# EasyEDA schematic cc2_schematic.json
TITLE: Foxie CardClock 2.0; REV: 1.1; Date: Oct 27, 2023; Sheet: 1/1; Drawn By: Will Fox; Company: Foxie Products
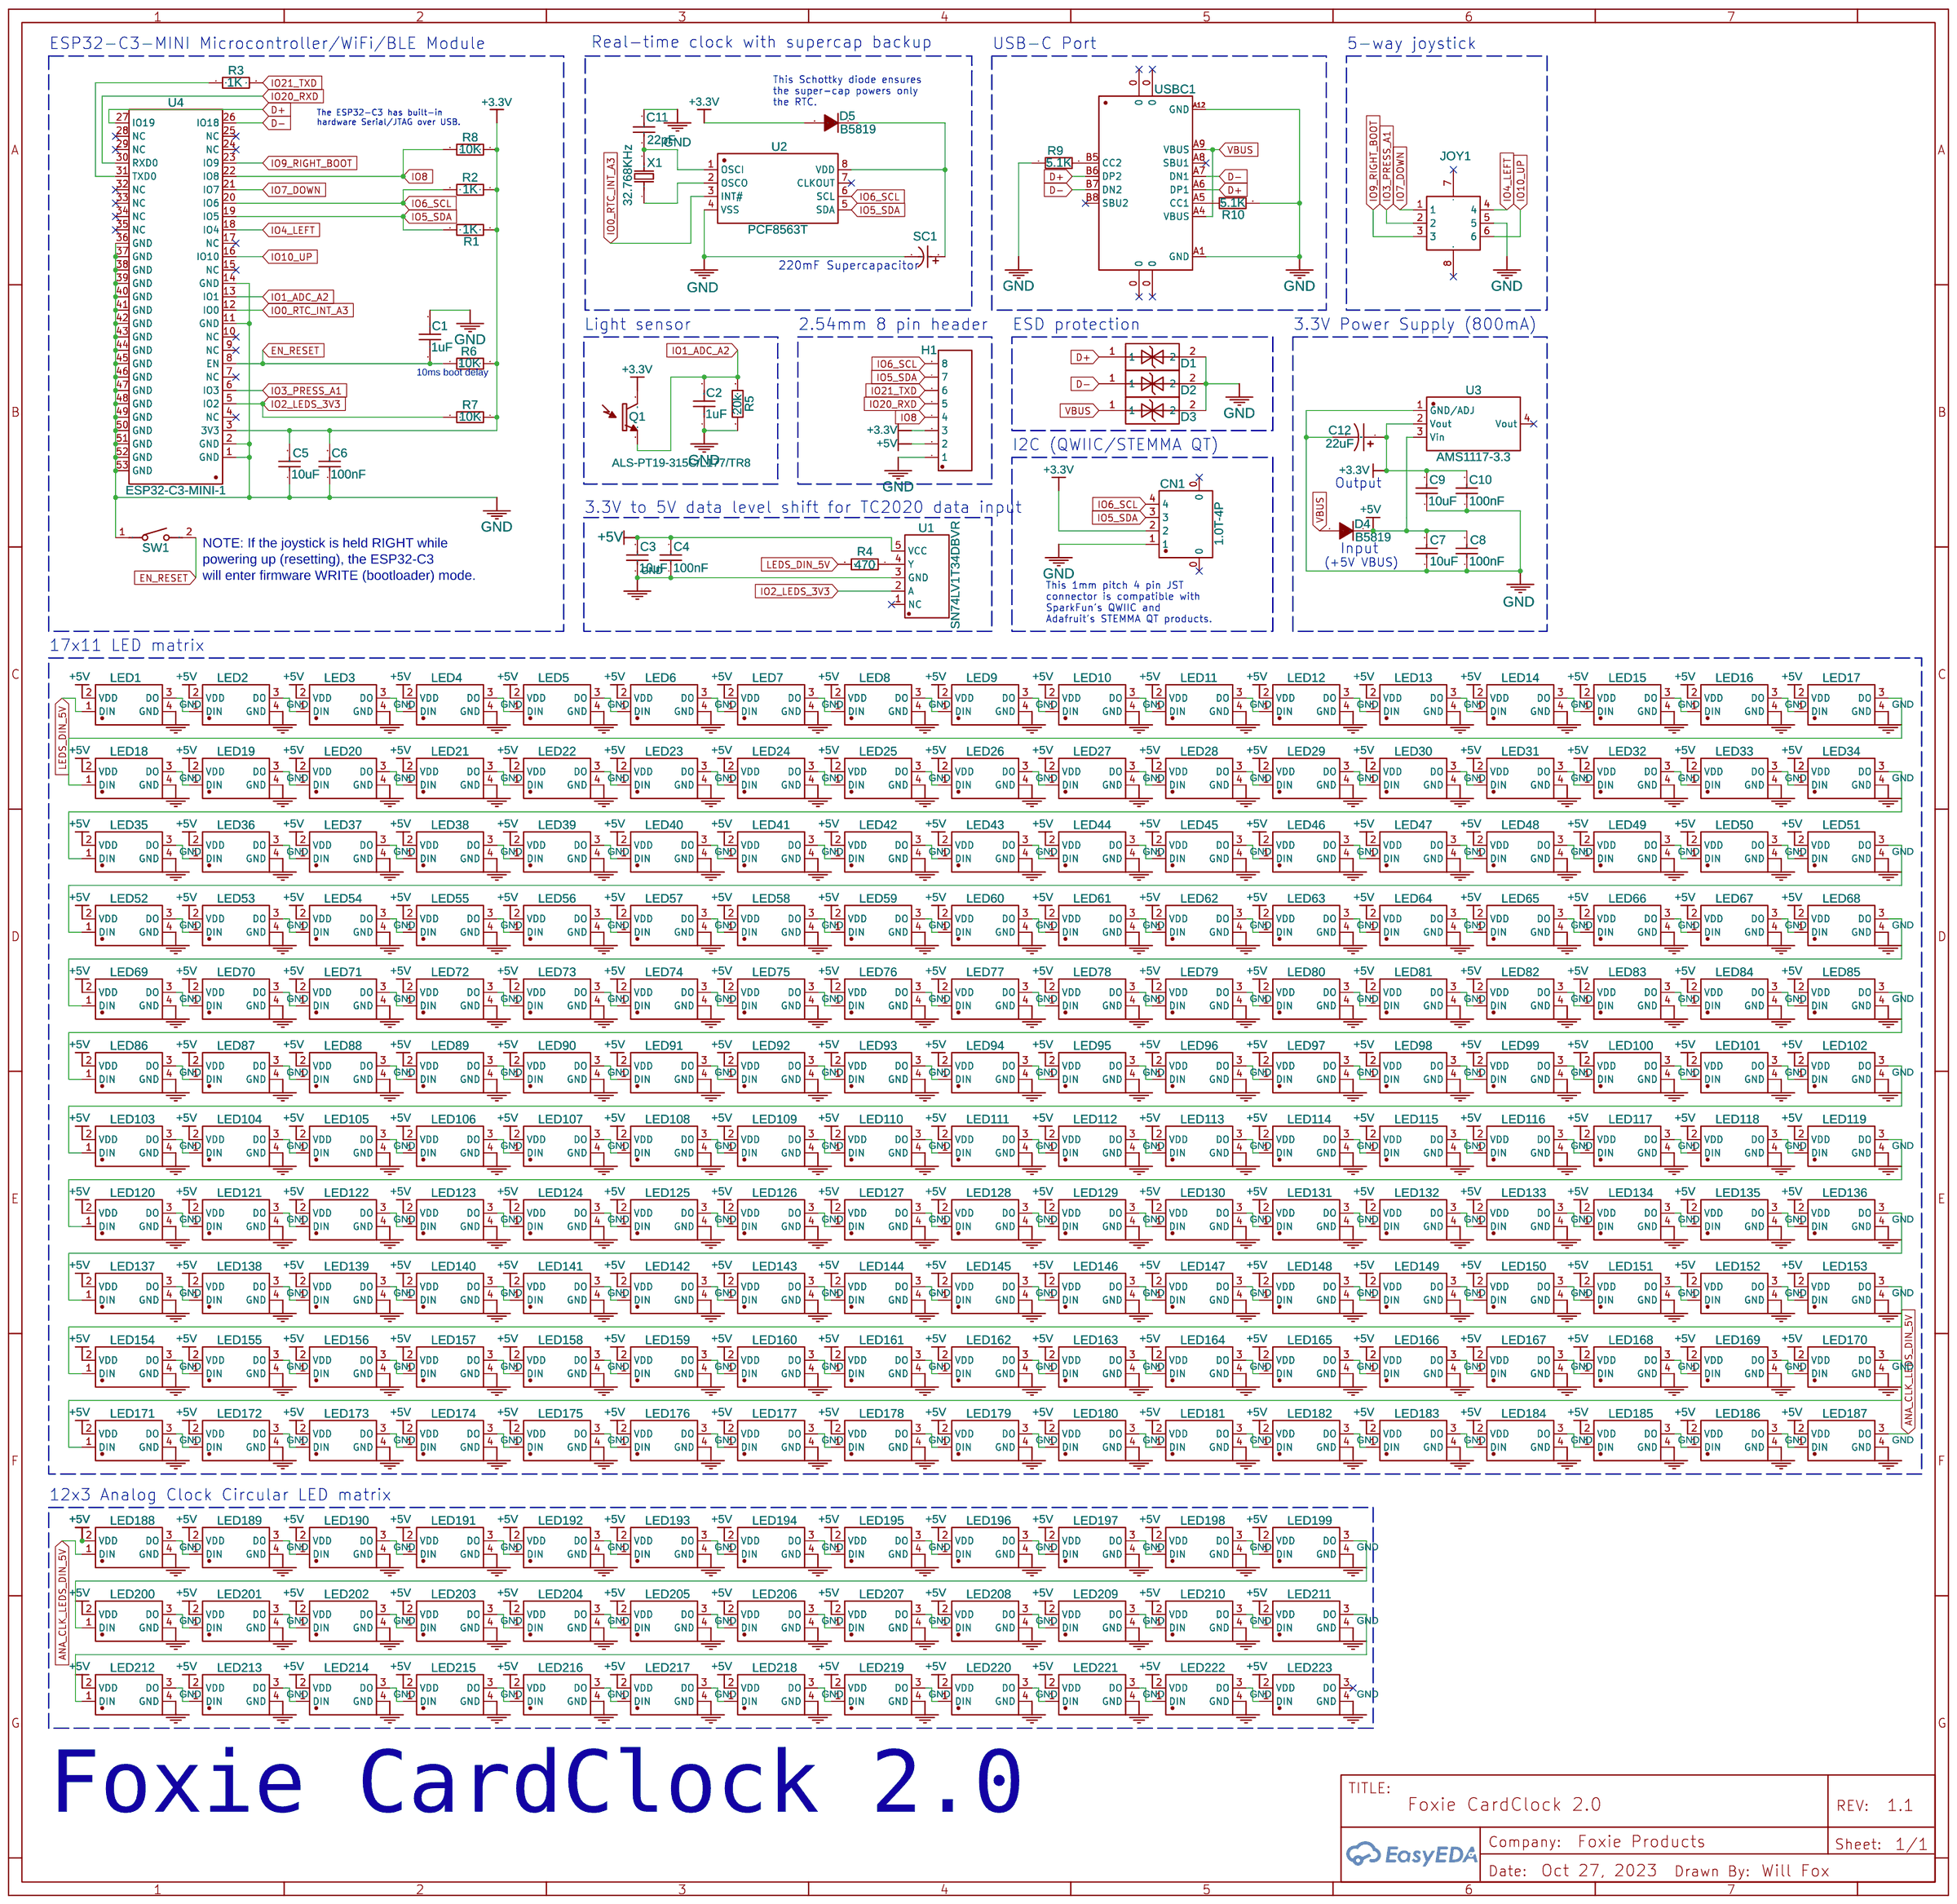
[diagram p0: schematic sheet]

## Parts
C1  1uF  [C0402]
C2  1uF  [C0402]
C3  10uF  [C0402]
C4  100nF  [C0402]
C5  10uF  [C0402]
C6  100nF  [C0402]
C7  10uF  [C0402]
C8  100nF  [C0402]
C9  10uF  [C0402]
C10  100nF  [C0402]
C11  22pF  [C0402]
C12  22uF  [CAP-SMD_L3.2-W1.6-RD]
CN1  1.0T-4P  [CONN-SMD_1.0T-4P]
D1  ULCE1005A015FR  [D0603-BI]
D2  ULCE1005A015FR  [D0603-BI]
D3  ULCE1005A015FR  [D0603-BI]
D4  B5819  [SOD-123_L2.8-W1.8-LS3.7-RD]
D5  B5819  [SOD-123_L2.8-W1.8-LS3.7-RD]
H1  Header-Male-2.54_1x8  [HDR-TH_8P-P2.54-V-M_OFFSET_PINS]
JOY1  K1-5202UA-02  [SW-SMD_K1-5202UA-02]
LED1  TC2020RGB-3CJH-TX1812Z5  [LED-SMD_4P-L2.1-W2.1-TL_TC2020RGB]
LED2  TC2020RGB-3CJH-TX1812Z5  [LED-SMD_4P-L2.1-W2.1-TL_TC2020RGB]
LED3  TC2020RGB-3CJH-TX1812Z5  [LED-SMD_4P-L2.1-W2.1-TL_TC2020RGB]
LED4  TC2020RGB-3CJH-TX1812Z5  [LED-SMD_4P-L2.1-W2.1-TL_TC2020RGB]
LED5  TC2020RGB-3CJH-TX1812Z5  [LED-SMD_4P-L2.1-W2.1-TL_TC2020RGB]
LED6  TC2020RGB-3CJH-TX1812Z5  [LED-SMD_4P-L2.1-W2.1-TL_TC2020RGB]
LED7  TC2020RGB-3CJH-TX1812Z5  [LED-SMD_4P-L2.1-W2.1-TL_TC2020RGB]
LED8  TC2020RGB-3CJH-TX1812Z5  [LED-SMD_4P-L2.1-W2.1-TL_TC2020RGB]
LED9  TC2020RGB-3CJH-TX1812Z5  [LED-SMD_4P-L2.1-W2.1-TL_TC2020RGB]
LED10  TC2020RGB-3CJH-TX1812Z5  [LED-SMD_4P-L2.1-W2.1-TL_TC2020RGB]
LED11  TC2020RGB-3CJH-TX1812Z5  [LED-SMD_4P-L2.1-W2.1-TL_TC2020RGB]
LED12  TC2020RGB-3CJH-TX1812Z5  [LED-SMD_4P-L2.1-W2.1-TL_TC2020RGB]
LED13  TC2020RGB-3CJH-TX1812Z5  [LED-SMD_4P-L2.1-W2.1-TL_TC2020RGB]
LED14  TC2020RGB-3CJH-TX1812Z5  [LED-SMD_4P-L2.1-W2.1-TL_TC2020RGB]
LED15  TC2020RGB-3CJH-TX1812Z5  [LED-SMD_4P-L2.1-W2.1-TL_TC2020RGB]
LED16  TC2020RGB-3CJH-TX1812Z5  [LED-SMD_4P-L2.1-W2.1-TL_TC2020RGB]
LED17  TC2020RGB-3CJH-TX1812Z5  [LED-SMD_4P-L2.1-W2.1-TL_TC2020RGB]
LED18  TC2020RGB-3CJH-TX1812Z5  [LED-SMD_4P-L2.1-W2.1-TL_TC2020RGB]
LED19  TC2020RGB-3CJH-TX1812Z5  [LED-SMD_4P-L2.1-W2.1-TL_TC2020RGB]
LED20  TC2020RGB-3CJH-TX1812Z5  [LED-SMD_4P-L2.1-W2.1-TL_TC2020RGB]
LED21  TC2020RGB-3CJH-TX1812Z5  [LED-SMD_4P-L2.1-W2.1-TL_TC2020RGB]
LED22  TC2020RGB-3CJH-TX1812Z5  [LED-SMD_4P-L2.1-W2.1-TL_TC2020RGB]
LED23  TC2020RGB-3CJH-TX1812Z5  [LED-SMD_4P-L2.1-W2.1-TL_TC2020RGB]
LED24  TC2020RGB-3CJH-TX1812Z5  [LED-SMD_4P-L2.1-W2.1-TL_TC2020RGB]
LED25  TC2020RGB-3CJH-TX1812Z5  [LED-SMD_4P-L2.1-W2.1-TL_TC2020RGB]
LED26  TC2020RGB-3CJH-TX1812Z5  [LED-SMD_4P-L2.1-W2.1-TL_TC2020RGB]
LED27  TC2020RGB-3CJH-TX1812Z5  [LED-SMD_4P-L2.1-W2.1-TL_TC2020RGB]
LED28  TC2020RGB-3CJH-TX1812Z5  [LED-SMD_4P-L2.1-W2.1-TL_TC2020RGB]
LED29  TC2020RGB-3CJH-TX1812Z5  [LED-SMD_4P-L2.1-W2.1-TL_TC2020RGB]
LED30  TC2020RGB-3CJH-TX1812Z5  [LED-SMD_4P-L2.1-W2.1-TL_TC2020RGB]
LED31  TC2020RGB-3CJH-TX1812Z5  [LED-SMD_4P-L2.1-W2.1-TL_TC2020RGB]
LED32  TC2020RGB-3CJH-TX1812Z5  [LED-SMD_4P-L2.1-W2.1-TL_TC2020RGB]
LED33  TC2020RGB-3CJH-TX1812Z5  [LED-SMD_4P-L2.1-W2.1-TL_TC2020RGB]
LED34  TC2020RGB-3CJH-TX1812Z5  [LED-SMD_4P-L2.1-W2.1-TL_TC2020RGB]
LED35  TC2020RGB-3CJH-TX1812Z5  [LED-SMD_4P-L2.1-W2.1-TL_TC2020RGB]
LED36  TC2020RGB-3CJH-TX1812Z5  [LED-SMD_4P-L2.1-W2.1-TL_TC2020RGB]
LED37  TC2020RGB-3CJH-TX1812Z5  [LED-SMD_4P-L2.1-W2.1-TL_TC2020RGB]
LED38  TC2020RGB-3CJH-TX1812Z5  [LED-SMD_4P-L2.1-W2.1-TL_TC2020RGB]
LED39  TC2020RGB-3CJH-TX1812Z5  [LED-SMD_4P-L2.1-W2.1-TL_TC2020RGB]
LED40  TC2020RGB-3CJH-TX1812Z5  [LED-SMD_4P-L2.1-W2.1-TL_TC2020RGB]
LED41  TC2020RGB-3CJH-TX1812Z5  [LED-SMD_4P-L2.1-W2.1-TL_TC2020RGB]
LED42  TC2020RGB-3CJH-TX1812Z5  [LED-SMD_4P-L2.1-W2.1-TL_TC2020RGB]
LED43  TC2020RGB-3CJH-TX1812Z5  [LED-SMD_4P-L2.1-W2.1-TL_TC2020RGB]
LED44  TC2020RGB-3CJH-TX1812Z5  [LED-SMD_4P-L2.1-W2.1-TL_TC2020RGB]
LED45  TC2020RGB-3CJH-TX1812Z5  [LED-SMD_4P-L2.1-W2.1-TL_TC2020RGB]
LED46  TC2020RGB-3CJH-TX1812Z5  [LED-SMD_4P-L2.1-W2.1-TL_TC2020RGB]
LED47  TC2020RGB-3CJH-TX1812Z5  [LED-SMD_4P-L2.1-W2.1-TL_TC2020RGB]
LED48  TC2020RGB-3CJH-TX1812Z5  [LED-SMD_4P-L2.1-W2.1-TL_TC2020RGB]
LED49  TC2020RGB-3CJH-TX1812Z5  [LED-SMD_4P-L2.1-W2.1-TL_TC2020RGB]
LED50  TC2020RGB-3CJH-TX1812Z5  [LED-SMD_4P-L2.1-W2.1-TL_TC2020RGB]
LED51  TC2020RGB-3CJH-TX1812Z5  [LED-SMD_4P-L2.1-W2.1-TL_TC2020RGB]
LED52  TC2020RGB-3CJH-TX1812Z5  [LED-SMD_4P-L2.1-W2.1-TL_TC2020RGB]
LED53  TC2020RGB-3CJH-TX1812Z5  [LED-SMD_4P-L2.1-W2.1-TL_TC2020RGB]
LED54  TC2020RGB-3CJH-TX1812Z5  [LED-SMD_4P-L2.1-W2.1-TL_TC2020RGB]
LED55  TC2020RGB-3CJH-TX1812Z5  [LED-SMD_4P-L2.1-W2.1-TL_TC2020RGB]
LED56  TC2020RGB-3CJH-TX1812Z5  [LED-SMD_4P-L2.1-W2.1-TL_TC2020RGB]
LED57  TC2020RGB-3CJH-TX1812Z5  [LED-SMD_4P-L2.1-W2.1-TL_TC2020RGB]
LED58  TC2020RGB-3CJH-TX1812Z5  [LED-SMD_4P-L2.1-W2.1-TL_TC2020RGB]
LED59  TC2020RGB-3CJH-TX1812Z5  [LED-SMD_4P-L2.1-W2.1-TL_TC2020RGB]
LED60  TC2020RGB-3CJH-TX1812Z5  [LED-SMD_4P-L2.1-W2.1-TL_TC2020RGB]
LED61  TC2020RGB-3CJH-TX1812Z5  [LED-SMD_4P-L2.1-W2.1-TL_TC2020RGB]
LED62  TC2020RGB-3CJH-TX1812Z5  [LED-SMD_4P-L2.1-W2.1-TL_TC2020RGB]
LED63  TC2020RGB-3CJH-TX1812Z5  [LED-SMD_4P-L2.1-W2.1-TL_TC2020RGB]
LED64  TC2020RGB-3CJH-TX1812Z5  [LED-SMD_4P-L2.1-W2.1-TL_TC2020RGB]
LED65  TC2020RGB-3CJH-TX1812Z5  [LED-SMD_4P-L2.1-W2.1-TL_TC2020RGB]
LED66  TC2020RGB-3CJH-TX1812Z5  [LED-SMD_4P-L2.1-W2.1-TL_TC2020RGB]
LED67  TC2020RGB-3CJH-TX1812Z5  [LED-SMD_4P-L2.1-W2.1-TL_TC2020RGB]
LED68  TC2020RGB-3CJH-TX1812Z5  [LED-SMD_4P-L2.1-W2.1-TL_TC2020RGB]
LED69  TC2020RGB-3CJH-TX1812Z5  [LED-SMD_4P-L2.1-W2.1-TL_TC2020RGB]
LED70  TC2020RGB-3CJH-TX1812Z5  [LED-SMD_4P-L2.1-W2.1-TL_TC2020RGB]
LED71  TC2020RGB-3CJH-TX1812Z5  [LED-SMD_4P-L2.1-W2.1-TL_TC2020RGB]
LED72  TC2020RGB-3CJH-TX1812Z5  [LED-SMD_4P-L2.1-W2.1-TL_TC2020RGB]
LED73  TC2020RGB-3CJH-TX1812Z5  [LED-SMD_4P-L2.1-W2.1-TL_TC2020RGB]
LED74  TC2020RGB-3CJH-TX1812Z5  [LED-SMD_4P-L2.1-W2.1-TL_TC2020RGB]
LED75  TC2020RGB-3CJH-TX1812Z5  [LED-SMD_4P-L2.1-W2.1-TL_TC2020RGB]
LED76  TC2020RGB-3CJH-TX1812Z5  [LED-SMD_4P-L2.1-W2.1-TL_TC2020RGB]
LED77  TC2020RGB-3CJH-TX1812Z5  [LED-SMD_4P-L2.1-W2.1-TL_TC2020RGB]
LED78  TC2020RGB-3CJH-TX1812Z5  [LED-SMD_4P-L2.1-W2.1-TL_TC2020RGB]
LED79  TC2020RGB-3CJH-TX1812Z5  [LED-SMD_4P-L2.1-W2.1-TL_TC2020RGB]
LED80  TC2020RGB-3CJH-TX1812Z5  [LED-SMD_4P-L2.1-W2.1-TL_TC2020RGB]
LED81  TC2020RGB-3CJH-TX1812Z5  [LED-SMD_4P-L2.1-W2.1-TL_TC2020RGB]
LED82  TC2020RGB-3CJH-TX1812Z5  [LED-SMD_4P-L2.1-W2.1-TL_TC2020RGB]
LED83  TC2020RGB-3CJH-TX1812Z5  [LED-SMD_4P-L2.1-W2.1-TL_TC2020RGB]
LED84  TC2020RGB-3CJH-TX1812Z5  [LED-SMD_4P-L2.1-W2.1-TL_TC2020RGB]
LED85  TC2020RGB-3CJH-TX1812Z5  [LED-SMD_4P-L2.1-W2.1-TL_TC2020RGB]
LED86  TC2020RGB-3CJH-TX1812Z5  [LED-SMD_4P-L2.1-W2.1-TL_TC2020RGB]
LED87  TC2020RGB-3CJH-TX1812Z5  [LED-SMD_4P-L2.1-W2.1-TL_TC2020RGB]
LED88  TC2020RGB-3CJH-TX1812Z5  [LED-SMD_4P-L2.1-W2.1-TL_TC2020RGB]
LED89  TC2020RGB-3CJH-TX1812Z5  [LED-SMD_4P-L2.1-W2.1-TL_TC2020RGB]
LED90  TC2020RGB-3CJH-TX1812Z5  [LED-SMD_4P-L2.1-W2.1-TL_TC2020RGB]
LED91  TC2020RGB-3CJH-TX1812Z5  [LED-SMD_4P-L2.1-W2.1-TL_TC2020RGB]
LED92  TC2020RGB-3CJH-TX1812Z5  [LED-SMD_4P-L2.1-W2.1-TL_TC2020RGB]
LED93  TC2020RGB-3CJH-TX1812Z5  [LED-SMD_4P-L2.1-W2.1-TL_TC2020RGB]
LED94  TC2020RGB-3CJH-TX1812Z5  [LED-SMD_4P-L2.1-W2.1-TL_TC2020RGB]
LED95  TC2020RGB-3CJH-TX1812Z5  [LED-SMD_4P-L2.1-W2.1-TL_TC2020RGB]
LED96  TC2020RGB-3CJH-TX1812Z5  [LED-SMD_4P-L2.1-W2.1-TL_TC2020RGB]
LED97  TC2020RGB-3CJH-TX1812Z5  [LED-SMD_4P-L2.1-W2.1-TL_TC2020RGB]
LED98  TC2020RGB-3CJH-TX1812Z5  [LED-SMD_4P-L2.1-W2.1-TL_TC2020RGB]
LED99  TC2020RGB-3CJH-TX1812Z5  [LED-SMD_4P-L2.1-W2.1-TL_TC2020RGB]
LED100  TC2020RGB-3CJH-TX1812Z5  [LED-SMD_4P-L2.1-W2.1-TL_TC2020RGB]
LED101  TC2020RGB-3CJH-TX1812Z5  [LED-SMD_4P-L2.1-W2.1-TL_TC2020RGB]
LED102  TC2020RGB-3CJH-TX1812Z5  [LED-SMD_4P-L2.1-W2.1-TL_TC2020RGB]
LED103  TC2020RGB-3CJH-TX1812Z5  [LED-SMD_4P-L2.1-W2.1-TL_TC2020RGB]
LED104  TC2020RGB-3CJH-TX1812Z5  [LED-SMD_4P-L2.1-W2.1-TL_TC2020RGB]
LED105  TC2020RGB-3CJH-TX1812Z5  [LED-SMD_4P-L2.1-W2.1-TL_TC2020RGB]
LED106  TC2020RGB-3CJH-TX1812Z5  [LED-SMD_4P-L2.1-W2.1-TL_TC2020RGB]
LED107  TC2020RGB-3CJH-TX1812Z5  [LED-SMD_4P-L2.1-W2.1-TL_TC2020RGB]
LED108  TC2020RGB-3CJH-TX1812Z5  [LED-SMD_4P-L2.1-W2.1-TL_TC2020RGB]
LED109  TC2020RGB-3CJH-TX1812Z5  [LED-SMD_4P-L2.1-W2.1-TL_TC2020RGB]
LED110  TC2020RGB-3CJH-TX1812Z5  [LED-SMD_4P-L2.1-W2.1-TL_TC2020RGB]
LED111  TC2020RGB-3CJH-TX1812Z5  [LED-SMD_4P-L2.1-W2.1-TL_TC2020RGB]
LED112  TC2020RGB-3CJH-TX1812Z5  [LED-SMD_4P-L2.1-W2.1-TL_TC2020RGB]
LED113  TC2020RGB-3CJH-TX1812Z5  [LED-SMD_4P-L2.1-W2.1-TL_TC2020RGB]
LED114  TC2020RGB-3CJH-TX1812Z5  [LED-SMD_4P-L2.1-W2.1-TL_TC2020RGB]
LED115  TC2020RGB-3CJH-TX1812Z5  [LED-SMD_4P-L2.1-W2.1-TL_TC2020RGB]
LED116  TC2020RGB-3CJH-TX1812Z5  [LED-SMD_4P-L2.1-W2.1-TL_TC2020RGB]
LED117  TC2020RGB-3CJH-TX1812Z5  [LED-SMD_4P-L2.1-W2.1-TL_TC2020RGB]
LED118  TC2020RGB-3CJH-TX1812Z5  [LED-SMD_4P-L2.1-W2.1-TL_TC2020RGB]
LED119  TC2020RGB-3CJH-TX1812Z5  [LED-SMD_4P-L2.1-W2.1-TL_TC2020RGB]
LED120  TC2020RGB-3CJH-TX1812Z5  [LED-SMD_4P-L2.1-W2.1-TL_TC2020RGB]
LED121  TC2020RGB-3CJH-TX1812Z5  [LED-SMD_4P-L2.1-W2.1-TL_TC2020RGB]
LED122  TC2020RGB-3CJH-TX1812Z5  [LED-SMD_4P-L2.1-W2.1-TL_TC2020RGB]
LED123  TC2020RGB-3CJH-TX1812Z5  [LED-SMD_4P-L2.1-W2.1-TL_TC2020RGB]
LED124  TC2020RGB-3CJH-TX1812Z5  [LED-SMD_4P-L2.1-W2.1-TL_TC2020RGB]
LED125  TC2020RGB-3CJH-TX1812Z5  [LED-SMD_4P-L2.1-W2.1-TL_TC2020RGB]
LED126  TC2020RGB-3CJH-TX1812Z5  [LED-SMD_4P-L2.1-W2.1-TL_TC2020RGB]
LED127  TC2020RGB-3CJH-TX1812Z5  [LED-SMD_4P-L2.1-W2.1-TL_TC2020RGB]
LED128  TC2020RGB-3CJH-TX1812Z5  [LED-SMD_4P-L2.1-W2.1-TL_TC2020RGB]
LED129  TC2020RGB-3CJH-TX1812Z5  [LED-SMD_4P-L2.1-W2.1-TL_TC2020RGB]
LED130  TC2020RGB-3CJH-TX1812Z5  [LED-SMD_4P-L2.1-W2.1-TL_TC2020RGB]
LED131  TC2020RGB-3CJH-TX1812Z5  [LED-SMD_4P-L2.1-W2.1-TL_TC2020RGB]
LED132  TC2020RGB-3CJH-TX1812Z5  [LED-SMD_4P-L2.1-W2.1-TL_TC2020RGB]
LED133  TC2020RGB-3CJH-TX1812Z5  [LED-SMD_4P-L2.1-W2.1-TL_TC2020RGB]
LED134  TC2020RGB-3CJH-TX1812Z5  [LED-SMD_4P-L2.1-W2.1-TL_TC2020RGB]
LED135  TC2020RGB-3CJH-TX1812Z5  [LED-SMD_4P-L2.1-W2.1-TL_TC2020RGB]
LED136  TC2020RGB-3CJH-TX1812Z5  [LED-SMD_4P-L2.1-W2.1-TL_TC2020RGB]
LED137  TC2020RGB-3CJH-TX1812Z5  [LED-SMD_4P-L2.1-W2.1-TL_TC2020RGB]
LED138  TC2020RGB-3CJH-TX1812Z5  [LED-SMD_4P-L2.1-W2.1-TL_TC2020RGB]
LED139  TC2020RGB-3CJH-TX1812Z5  [LED-SMD_4P-L2.1-W2.1-TL_TC2020RGB]
LED140  TC2020RGB-3CJH-TX1812Z5  [LED-SMD_4P-L2.1-W2.1-TL_TC2020RGB]
LED141  TC2020RGB-3CJH-TX1812Z5  [LED-SMD_4P-L2.1-W2.1-TL_TC2020RGB]
LED142  TC2020RGB-3CJH-TX1812Z5  [LED-SMD_4P-L2.1-W2.1-TL_TC2020RGB]
LED143  TC2020RGB-3CJH-TX1812Z5  [LED-SMD_4P-L2.1-W2.1-TL_TC2020RGB]
LED144  TC2020RGB-3CJH-TX1812Z5  [LED-SMD_4P-L2.1-W2.1-TL_TC2020RGB]
LED145  TC2020RGB-3CJH-TX1812Z5  [LED-SMD_4P-L2.1-W2.1-TL_TC2020RGB]
LED146  TC2020RGB-3CJH-TX1812Z5  [LED-SMD_4P-L2.1-W2.1-TL_TC2020RGB]
LED147  TC2020RGB-3CJH-TX1812Z5  [LED-SMD_4P-L2.1-W2.1-TL_TC2020RGB]
LED148  TC2020RGB-3CJH-TX1812Z5  [LED-SMD_4P-L2.1-W2.1-TL_TC2020RGB]
LED149  TC2020RGB-3CJH-TX1812Z5  [LED-SMD_4P-L2.1-W2.1-TL_TC2020RGB]
LED150  TC2020RGB-3CJH-TX1812Z5  [LED-SMD_4P-L2.1-W2.1-TL_TC2020RGB]
LED151  TC2020RGB-3CJH-TX1812Z5  [LED-SMD_4P-L2.1-W2.1-TL_TC2020RGB]
LED152  TC2020RGB-3CJH-TX1812Z5  [LED-SMD_4P-L2.1-W2.1-TL_TC2020RGB]
LED153  TC2020RGB-3CJH-TX1812Z5  [LED-SMD_4P-L2.1-W2.1-TL_TC2020RGB]
LED154  TC2020RGB-3CJH-TX1812Z5  [LED-SMD_4P-L2.1-W2.1-TL_TC2020RGB]
LED155  TC2020RGB-3CJH-TX1812Z5  [LED-SMD_4P-L2.1-W2.1-TL_TC2020RGB]
LED156  TC2020RGB-3CJH-TX1812Z5  [LED-SMD_4P-L2.1-W2.1-TL_TC2020RGB]
LED157  TC2020RGB-3CJH-TX1812Z5  [LED-SMD_4P-L2.1-W2.1-TL_TC2020RGB]
LED158  TC2020RGB-3CJH-TX1812Z5  [LED-SMD_4P-L2.1-W2.1-TL_TC2020RGB]
LED159  TC2020RGB-3CJH-TX1812Z5  [LED-SMD_4P-L2.1-W2.1-TL_TC2020RGB]
LED160  TC2020RGB-3CJH-TX1812Z5  [LED-SMD_4P-L2.1-W2.1-TL_TC2020RGB]
LED161  TC2020RGB-3CJH-TX1812Z5  [LED-SMD_4P-L2.1-W2.1-TL_TC2020RGB]
LED162  TC2020RGB-3CJH-TX1812Z5  [LED-SMD_4P-L2.1-W2.1-TL_TC2020RGB]
LED163  TC2020RGB-3CJH-TX1812Z5  [LED-SMD_4P-L2.1-W2.1-TL_TC2020RGB]
LED164  TC2020RGB-3CJH-TX1812Z5  [LED-SMD_4P-L2.1-W2.1-TL_TC2020RGB]
LED165  TC2020RGB-3CJH-TX1812Z5  [LED-SMD_4P-L2.1-W2.1-TL_TC2020RGB]
LED166  TC2020RGB-3CJH-TX1812Z5  [LED-SMD_4P-L2.1-W2.1-TL_TC2020RGB]
LED167  TC2020RGB-3CJH-TX1812Z5  [LED-SMD_4P-L2.1-W2.1-TL_TC2020RGB]
LED168  TC2020RGB-3CJH-TX1812Z5  [LED-SMD_4P-L2.1-W2.1-TL_TC2020RGB]
LED169  TC2020RGB-3CJH-TX1812Z5  [LED-SMD_4P-L2.1-W2.1-TL_TC2020RGB]
LED170  TC2020RGB-3CJH-TX1812Z5  [LED-SMD_4P-L2.1-W2.1-TL_TC2020RGB]
LED171  TC2020RGB-3CJH-TX1812Z5  [LED-SMD_4P-L2.1-W2.1-TL_TC2020RGB]
LED172  TC2020RGB-3CJH-TX1812Z5  [LED-SMD_4P-L2.1-W2.1-TL_TC2020RGB]
LED173  TC2020RGB-3CJH-TX1812Z5  [LED-SMD_4P-L2.1-W2.1-TL_TC2020RGB]
LED174  TC2020RGB-3CJH-TX1812Z5  [LED-SMD_4P-L2.1-W2.1-TL_TC2020RGB]
LED175  TC2020RGB-3CJH-TX1812Z5  [LED-SMD_4P-L2.1-W2.1-TL_TC2020RGB]
LED176  TC2020RGB-3CJH-TX1812Z5  [LED-SMD_4P-L2.1-W2.1-TL_TC2020RGB]
LED177  TC2020RGB-3CJH-TX1812Z5  [LED-SMD_4P-L2.1-W2.1-TL_TC2020RGB]
LED178  TC2020RGB-3CJH-TX1812Z5  [LED-SMD_4P-L2.1-W2.1-TL_TC2020RGB]
LED179  TC2020RGB-3CJH-TX1812Z5  [LED-SMD_4P-L2.1-W2.1-TL_TC2020RGB]
LED180  TC2020RGB-3CJH-TX1812Z5  [LED-SMD_4P-L2.1-W2.1-TL_TC2020RGB]
LED181  TC2020RGB-3CJH-TX1812Z5  [LED-SMD_4P-L2.1-W2.1-TL_TC2020RGB]
LED182  TC2020RGB-3CJH-TX1812Z5  [LED-SMD_4P-L2.1-W2.1-TL_TC2020RGB]
LED183  TC2020RGB-3CJH-TX1812Z5  [LED-SMD_4P-L2.1-W2.1-TL_TC2020RGB]
LED184  TC2020RGB-3CJH-TX1812Z5  [LED-SMD_4P-L2.1-W2.1-TL_TC2020RGB]
LED185  TC2020RGB-3CJH-TX1812Z5  [LED-SMD_4P-L2.1-W2.1-TL_TC2020RGB]
LED186  TC2020RGB-3CJH-TX1812Z5  [LED-SMD_4P-L2.1-W2.1-TL_TC2020RGB]
LED187  TC2020RGB-3CJH-TX1812Z5  [LED-SMD_4P-L2.1-W2.1-TL_TC2020RGB]
LED188  TC2020RGB-3CJH-TX1812Z5  [LED-SMD_4P-L2.1-W2.1-TL_TC2020RGB]
LED189  TC2020RGB-3CJH-TX1812Z5  [LED-SMD_4P-L2.1-W2.1-TL_TC2020RGB]
LED190  TC2020RGB-3CJH-TX1812Z5  [LED-SMD_4P-L2.1-W2.1-TL_TC2020RGB]
LED191  TC2020RGB-3CJH-TX1812Z5  [LED-SMD_4P-L2.1-W2.1-TL_TC2020RGB]
LED192  TC2020RGB-3CJH-TX1812Z5  [LED-SMD_4P-L2.1-W2.1-TL_TC2020RGB]
LED193  TC2020RGB-3CJH-TX1812Z5  [LED-SMD_4P-L2.1-W2.1-TL_TC2020RGB]
LED194  TC2020RGB-3CJH-TX1812Z5  [LED-SMD_4P-L2.1-W2.1-TL_TC2020RGB]
LED195  TC2020RGB-3CJH-TX1812Z5  [LED-SMD_4P-L2.1-W2.1-TL_TC2020RGB]
LED196  TC2020RGB-3CJH-TX1812Z5  [LED-SMD_4P-L2.1-W2.1-TL_TC2020RGB]
LED197  TC2020RGB-3CJH-TX1812Z5  [LED-SMD_4P-L2.1-W2.1-TL_TC2020RGB]
LED198  TC2020RGB-3CJH-TX1812Z5  [LED-SMD_4P-L2.1-W2.1-TL_TC2020RGB]
LED199  TC2020RGB-3CJH-TX1812Z5  [LED-SMD_4P-L2.1-W2.1-TL_TC2020RGB]
LED200  TC2020RGB-3CJH-TX1812Z5  [LED-SMD_4P-L2.1-W2.1-TL_TC2020RGB]
LED201  TC2020RGB-3CJH-TX1812Z5  [LED-SMD_4P-L2.1-W2.1-TL_TC2020RGB]
LED202  TC2020RGB-3CJH-TX1812Z5  [LED-SMD_4P-L2.1-W2.1-TL_TC2020RGB]
LED203  TC2020RGB-3CJH-TX1812Z5  [LED-SMD_4P-L2.1-W2.1-TL_TC2020RGB]
LED204  TC2020RGB-3CJH-TX1812Z5  [LED-SMD_4P-L2.1-W2.1-TL_TC2020RGB]
LED205  TC2020RGB-3CJH-TX1812Z5  [LED-SMD_4P-L2.1-W2.1-TL_TC2020RGB]
LED206  TC2020RGB-3CJH-TX1812Z5  [LED-SMD_4P-L2.1-W2.1-TL_TC2020RGB]
LED207  TC2020RGB-3CJH-TX1812Z5  [LED-SMD_4P-L2.1-W2.1-TL_TC2020RGB]
LED208  TC2020RGB-3CJH-TX1812Z5  [LED-SMD_4P-L2.1-W2.1-TL_TC2020RGB]
LED209  TC2020RGB-3CJH-TX1812Z5  [LED-SMD_4P-L2.1-W2.1-TL_TC2020RGB]
LED210  TC2020RGB-3CJH-TX1812Z5  [LED-SMD_4P-L2.1-W2.1-TL_TC2020RGB]
LED211  TC2020RGB-3CJH-TX1812Z5  [LED-SMD_4P-L2.1-W2.1-TL_TC2020RGB]
LED212  TC2020RGB-3CJH-TX1812Z5  [LED-SMD_4P-L2.1-W2.1-TL_TC2020RGB]
LED213  TC2020RGB-3CJH-TX1812Z5  [LED-SMD_4P-L2.1-W2.1-TL_TC2020RGB]
LED214  TC2020RGB-3CJH-TX1812Z5  [LED-SMD_4P-L2.1-W2.1-TL_TC2020RGB]
LED215  TC2020RGB-3CJH-TX1812Z5  [LED-SMD_4P-L2.1-W2.1-TL_TC2020RGB]
LED216  TC2020RGB-3CJH-TX1812Z5  [LED-SMD_4P-L2.1-W2.1-TL_TC2020RGB]
LED217  TC2020RGB-3CJH-TX1812Z5  [LED-SMD_4P-L2.1-W2.1-TL_TC2020RGB]
LED218  TC2020RGB-3CJH-TX1812Z5  [LED-SMD_4P-L2.1-W2.1-TL_TC2020RGB]
LED219  TC2020RGB-3CJH-TX1812Z5  [LED-SMD_4P-L2.1-W2.1-TL_TC2020RGB]
LED220  TC2020RGB-3CJH-TX1812Z5  [LED-SMD_4P-L2.1-W2.1-TL_TC2020RGB]
LED221  TC2020RGB-3CJH-TX1812Z5  [LED-SMD_4P-L2.1-W2.1-TL_TC2020RGB]
LED222  TC2020RGB-3CJH-TX1812Z5  [LED-SMD_4P-L2.1-W2.1-TL_TC2020RGB]
LED223  TC2020RGB-3CJH-TX1812Z5  [LED-SMD_4P-L2.1-W2.1-TL_TC2020RGB]
Q1  ALS-PT19-315C/L177/TR8  [SENSORS-SMD_ALS-PT19 (FIXED FOOTPRINT)]
R1  1K  [R0402]
R2  1K  [R0402]
R3  1K  [R0402]
R4  470  [R0402]
R5  20k  [R0402]
R6  10K  [R0402]
R7  10K  [R0402]
R8  10K  [R0402]
R9  5.1K  [R0402]
R10  5.1K  [R0402]
SC1  70mF  [CAP-SMD_2P-L4.8-W4.8-TR]
SW1  TS-1088-AR02016  [SW-SMD_L4.0-W2.9-LS5.0]
U1  SN74LV1T34DBVR  [SOT-23-5_L3.0-W1.7-P0.95-LS2.8-BR]
U2  PCF8563T  [SOIC-8_L5.0-W4.0-P1.27-LS6.0-BL]
U3  AMS1117-3.3  [SOT-223-3_L6.5-W3.4-P2.30-LS7.0-BR]
U4  ESP32-C3-MINI-1  [WIFIM-SMD_ESP32-C3-MINI-1]
USBC1  USB3.1C16PFSMT  [USB-C-SMD_TYPE-C-USB-17]
X1  32.768KHz  [FC-135R_L3.2-W1.5]

## Library data of the parts
C1 C2 = CL05A105KA5NQNC: Supplier: LCSC; Manufacturer: SAMSUNG; Supplier Part: C52923; JLCPCB Part Class: Basic Part
C3 C5 C7 C9 = CL05A106MQ5NUNC: Supplier: LCSC; Manufacturer: SAMSUNG; Supplier Part: C15525; SMT Type: Basic; JLCPCB SMD: Yes; LCSC Assembly: Yes
C4 C6 C8 C10 = CL05B104KO5NNNC: Supplier: LCSC; Manufacturer: SAMSUNG; Supplier Part: C1525; SMT Type: Basic; JLCPCB SMD: Yes; LCSC Assembly: Yes
C11 = 0402CG220J500NT: Supplier: LCSC; Manufacturer: FH; Supplier Part: C1555; SMT Type: Basic; JLCPCB SMD: Yes; LCSC Assembly: Yes
C12 = TC212A226K010Y: Supplier: LCSC; Manufacturer: Sunlord; Supplier Part: C108526; JLCPCB Part Class: Extended Part
CN1 = 1.0T-4P_C145956: Supplier: LCSC; Supplier Part: C145956; Manufacturer: Boom Precision Elec; Contributor: 立创EDA官方封装库; JLCPCB Part Class: Extended Part
D1-D3 = ULCE1005A015FR: Supplier: LCSC; Manufacturer: ICT; Contributor: LCSC; Supplier Part: C125064; JLCPCB Part Class: Extended Part
D4 D5 = B5819W_C8598: Supplier: LCSC; Manufacturer: CJ; Manufacturer Part: B5819W; image: //image.lceda.cn/szlcsc/C8598.jpg; Supplier Part: C8598; SMT Type: Basic; JLCPCB SMD: Yes; LCSC Assembly: Yes
H1 = Header-Male-2.54_1x8: Supplier: LCSC; Manufacturer: Ckmtw; Manufacturer Part: 210S-1*8P L=11.6MMGold-plated black; Contributor: LCSC; Supplier Part: C124381; LCSC Assembly: Yes; SMT Type: Extend; Paste Type: expand
JOY1 = K1-5202UA-02: Supplier: LCSC; Manufacturer: HRO; Contributor: LCSC; Supplier Part: C145900; JLCPCB Part Class: Extended Part
LED1-LED223 = TC2020RGB-3CJH-TX1812Z5: Supplier: LCSC; Supplier Part: C784564; Manufacturer: TCWIN; Contributor: LCSC; JLCPCB Part Class: Extended Part
Q1 = ALS-PT19-315C/L177/TR8: Supplier: LCSC; Manufacturer: EVERLIGHT; Contributor: LCSC; Supplier Part: C146233; LCSC Assembly: Yes; SMT Type: Extend
R1-R3 = 0402WGF1001TCE: Supplier: LCSC; Manufacturer: UniOhm; Supplier Part: C11702; SMT Type: Basic; JLCPCB SMD: Yes; LCSC Assembly: Yes
R4 = 0402WGF4700TCE: Supplier: LCSC; Manufacturer: UniOhm; Supplier Part: C25117; SMT Type: Basic; JLCPCB SMD: Yes; LCSC Assembly: Yes
R5 = 0402WGF2002TCE: Supplier: LCSC; Manufacturer: UniOhm; Supplier Part: C25765; Resistance (Ohms): 20K; JLCPCB Part Class: Basic Part
R6-R8 = 0402WGF1002TCE: Supplier: LCSC; Manufacturer: UniOhm; Supplier Part: C25744; SMT Type: Basic; JLCPCB SMD: Yes; LCSC Assembly: Yes
R9 R10 = 0402WGF5101TCE: Supplier: LCSC; Manufacturer: UniOhm; Supplier Part: C25905; SMT Type: Basic; JLCPCB SMD: Yes; LCSC Assembly: Yes
SC1 = SM3R3703T01U: Supplier: LCSC; Supplier Part: C396469; Manufacturer: KORCHIP(高奇普); Contributor: LCSC; JLCPCB Part Class: Extended Part
SW1 = TS-1088-AR02016: Supplier: LCSC; Supplier Part: C720477; Manufacturer: XUNPU; Contributor: LCSC; LCSC Assembly: Yes; SMT Type: Extend; Paste Type: expand
U1 = SN74LV1T34DBVR: Supplier: LCSC; Manufacturer: TI; Supplier Part: C100024; JLCPCB Part Class: Extended Part
U2 = PCF8563T/5,518: Supplier: LCSC; Manufacturer: NXP; image: //image.lceda.cn/szlcsc/C7440.jpg; Supplier Part: C7440; SMT Type: Basic; JLCPCB SMD: Yes; LCSC Assembly: Yes
U3 = AMS1117-3.3: sourceId: dwIGgezVh; Supplier: LCSC; Manufacturer: AMS; image: //image.lceda.cn/szlcsc/C6186.jpg; Supplier Part: C6186; SMT Type: Basic; JLCPCB SMD: Yes; LCSC Assembly: Yes
U4 = ESP32-C3-MINI-1-N4: Supplier: LCSC; Supplier Part: C2838502; Manufacturer: ESPRESSIF 乐鑫; Contributor: LCSC; JLCPCB Part Class: Extended Part
USBC1 = USB3.1C16PFSMT: Supplier: LCSC; Supplier Part: C167321; Manufacturer: LCSC; Contributor: LCSC; JLCPCB Part Class: Extended Part
X1 = Q13FC1350000400: Supplier: LCSC; Manufacturer: EPSON; Supplier Part: C32346; SMT Type: Basic; JLCPCB SMD: Yes; LCSC Assembly: Yes

## Nets
+3.3V: C5.2 C6.2 C9.2 C10.2 C12.1 CN1.2 D5.2(+) H1.3 Q1.1(C1) R1.1 R2.1 R6.2 R7.1 R8.1 U3.2(Vout) U4.3(3V3)
+5V: C3.2 C4.2 C7.2 C8.2 D4.1(-) H1.2 LED1.2(VDD) LED2.2(VDD) LED3.2(VDD) LED4.2(VDD) LED5.2(VDD) LED6.2(VDD) LED7.2(VDD) LED8.2(VDD) LED9.2(VDD) LED10.2(VDD) LED11.2(VDD) LED12.2(VDD) LED13.2(VDD) LED14.2(VDD) LED15.2(VDD) LED16.2(VDD) LED17.2(VDD) LED18.2(VDD) LED19.2(VDD) LED20.2(VDD) LED21.2(VDD) LED22.2(VDD) LED23.2(VDD) LED24.2(VDD) LED25.2(VDD) LED26.2(VDD) LED27.2(VDD) LED28.2(VDD) LED29.2(VDD) LED30.2(VDD) LED31.2(VDD) LED32.2(VDD) LED33.2(VDD) LED34.2(VDD) LED35.2(VDD) LED36.2(VDD) LED37.2(VDD) LED38.2(VDD) LED39.2(VDD) LED40.2(VDD) LED41.2(VDD) LED42.2(VDD) LED43.2(VDD) LED44.2(VDD) LED45.2(VDD) LED46.2(VDD) LED47.2(VDD) LED48.2(VDD) LED49.2(VDD) LED50.2(VDD) LED51.2(VDD) LED52.2(VDD) LED53.2(VDD) LED54.2(VDD) LED55.2(VDD) LED56.2(VDD) LED57.2(VDD) LED58.2(VDD) LED59.2(VDD) LED60.2(VDD) LED61.2(VDD) LED62.2(VDD) LED63.2(VDD) LED64.2(VDD) LED65.2(VDD) LED66.2(VDD) LED67.2(VDD) LED68.2(VDD) LED69.2(VDD) LED70.2(VDD) LED71.2(VDD) LED72.2(VDD) LED73.2(VDD) LED74.2(VDD) LED75.2(VDD) LED76.2(VDD) LED77.2(VDD) LED78.2(VDD) LED79.2(VDD) LED80.2(VDD) LED81.2(VDD) LED82.2(VDD) LED83.2(VDD) LED84.2(VDD) LED85.2(VDD) LED86.2(VDD) LED87.2(VDD) LED88.2(VDD) LED89.2(VDD) LED90.2(VDD) LED91.2(VDD) LED92.2(VDD) LED93.2(VDD) LED94.2(VDD) LED95.2(VDD) LED96.2(VDD) LED97.2(VDD) LED98.2(VDD) LED99.2(VDD) LED100.2(VDD) LED101.2(VDD) LED102.2(VDD) LED103.2(VDD) LED104.2(VDD) LED105.2(VDD) LED106.2(VDD) LED107.2(VDD) LED108.2(VDD) LED109.2(VDD) LED110.2(VDD) LED111.2(VDD) LED112.2(VDD) LED113.2(VDD) LED114.2(VDD) LED115.2(VDD) LED116.2(VDD) LED117.2(VDD) LED118.2(VDD) LED119.2(VDD) LED120.2(VDD) LED121.2(VDD) LED122.2(VDD) LED123.2(VDD) LED124.2(VDD) LED125.2(VDD) LED126.2(VDD) LED127.2(VDD) LED128.2(VDD) LED129.2(VDD) LED130.2(VDD) LED131.2(VDD) LED132.2(VDD) LED133.2(VDD) LED134.2(VDD) LED135.2(VDD) LED136.2(VDD) LED137.2(VDD) LED138.2(VDD) LED139.2(VDD) LED140.2(VDD) LED141.2(VDD) LED142.2(VDD) LED143.2(VDD) LED144.2(VDD) LED145.2(VDD) LED146.2(VDD) LED147.2(VDD) LED148.2(VDD) LED149.2(VDD) LED150.2(VDD) LED151.2(VDD) LED152.2(VDD) LED153.2(VDD) LED154.2(VDD) LED155.2(VDD) LED156.2(VDD) LED157.2(VDD) LED158.2(VDD) LED159.2(VDD) LED160.2(VDD) LED161.2(VDD) LED162.2(VDD) LED163.2(VDD) LED164.2(VDD) LED165.2(VDD) LED166.2(VDD) LED167.2(VDD) LED168.2(VDD) LED169.2(VDD) LED170.2(VDD) LED171.2(VDD) LED172.2(VDD) LED173.2(VDD) LED174.2(VDD) LED175.2(VDD) LED176.2(VDD) LED177.2(VDD) LED178.2(VDD) LED179.2(VDD) LED180.2(VDD) LED181.2(VDD) LED182.2(VDD) LED183.2(VDD) LED184.2(VDD) LED185.2(VDD) LED186.2(VDD) LED187.2(VDD) LED188.2(VDD) LED189.2(VDD) LED190.2(VDD) LED191.2(VDD) LED192.2(VDD) LED193.2(VDD) LED194.2(VDD) LED195.2(VDD) LED196.2(VDD) LED197.2(VDD) LED198.2(VDD) LED199.2(VDD) LED200.2(VDD) LED201.2(VDD) LED202.2(VDD) LED203.2(VDD) LED204.2(VDD) LED205.2(VDD) LED206.2(VDD) LED207.2(VDD) LED208.2(VDD) LED209.2(VDD) LED210.2(VDD) LED211.2(VDD) LED212.2(VDD) LED213.2(VDD) LED214.2(VDD) LED215.2(VDD) LED216.2(VDD) LED217.2(VDD) LED218.2(VDD) LED219.2(VDD) LED220.2(VDD) LED221.2(VDD) LED222.2(VDD) LED223.2(VDD) U1.5(VCC) U3.3(Vin)
GND: C1.2 C2.1 C3.1 C4.1 C5.1 C6.1 C7.1 C8.1 C9.1 C10.1 C11.2 C12.2 CN1.1 D1.2 D2.2 D3.2 H1.1 JOY1.5 LED1.4(GND) LED2.4(GND) LED3.4(GND) LED4.4(GND) LED5.4(GND) LED6.4(GND) LED7.4(GND) LED8.4(GND) LED9.4(GND) LED10.4(GND) LED11.4(GND) LED12.4(GND) LED13.4(GND) LED14.4(GND) LED15.4(GND) LED16.4(GND) LED17.4(GND) LED18.4(GND) LED19.4(GND) LED20.4(GND) LED21.4(GND) LED22.4(GND) LED23.4(GND) LED24.4(GND) LED25.4(GND) LED26.4(GND) LED27.4(GND) LED28.4(GND) LED29.4(GND) LED30.4(GND) LED31.4(GND) LED32.4(GND) LED33.4(GND) LED34.4(GND) LED35.4(GND) LED36.4(GND) LED37.4(GND) LED38.4(GND) LED39.4(GND) LED40.4(GND) LED41.4(GND) LED42.4(GND) LED43.4(GND) LED44.4(GND) LED45.4(GND) LED46.4(GND) LED47.4(GND) LED48.4(GND) LED49.4(GND) LED50.4(GND) LED51.4(GND) LED52.4(GND) LED53.4(GND) LED54.4(GND) LED55.4(GND) LED56.4(GND) LED57.4(GND) LED58.4(GND) LED59.4(GND) LED60.4(GND) LED61.4(GND) LED62.4(GND) LED63.4(GND) LED64.4(GND) LED65.4(GND) LED66.4(GND) LED67.4(GND) LED68.4(GND) LED69.4(GND) LED70.4(GND) LED71.4(GND) LED72.4(GND) LED73.4(GND) LED74.4(GND) LED75.4(GND) LED76.4(GND) LED77.4(GND) LED78.4(GND) LED79.4(GND) LED80.4(GND) LED81.4(GND) LED82.4(GND) LED83.4(GND) LED84.4(GND) LED85.4(GND) LED86.4(GND) LED87.4(GND) LED88.4(GND) LED89.4(GND) LED90.4(GND) LED91.4(GND) LED92.4(GND) LED93.4(GND) LED94.4(GND) LED95.4(GND) LED96.4(GND) LED97.4(GND) LED98.4(GND) LED99.4(GND) LED100.4(GND) LED101.4(GND) LED102.4(GND) LED103.4(GND) LED104.4(GND) LED105.4(GND) LED106.4(GND) LED107.4(GND) LED108.4(GND) LED109.4(GND) LED110.4(GND) LED111.4(GND) LED112.4(GND) LED113.4(GND) LED114.4(GND) LED115.4(GND) LED116.4(GND) LED117.4(GND) LED118.4(GND) LED119.4(GND) LED120.4(GND) LED121.4(GND) LED122.4(GND) LED123.4(GND) LED124.4(GND) LED125.4(GND) LED126.4(GND) LED127.4(GND) LED128.4(GND) LED129.4(GND) LED130.4(GND) LED131.4(GND) LED132.4(GND) LED133.4(GND) LED134.4(GND) LED135.4(GND) LED136.4(GND) LED137.4(GND) LED138.4(GND) LED139.4(GND) LED140.4(GND) LED141.4(GND) LED142.4(GND) LED143.4(GND) LED144.4(GND) LED145.4(GND) LED146.4(GND) LED147.4(GND) LED148.4(GND) LED149.4(GND) LED150.4(GND) LED151.4(GND) LED152.4(GND) LED153.4(GND) LED154.4(GND) LED155.4(GND) LED156.4(GND) LED157.4(GND) LED158.4(GND) LED159.4(GND) LED160.4(GND) LED161.4(GND) LED162.4(GND) LED163.4(GND) LED164.4(GND) LED165.4(GND) LED166.4(GND) LED167.4(GND) LED168.4(GND) LED169.4(GND) LED170.4(GND) LED171.4(GND) LED172.4(GND) LED173.4(GND) LED174.4(GND) LED175.4(GND) LED176.4(GND) LED177.4(GND) LED178.4(GND) LED179.4(GND) LED180.4(GND) LED181.4(GND) LED182.4(GND) LED183.4(GND) LED184.4(GND) LED185.4(GND) LED186.4(GND) LED187.4(GND) LED188.4(GND) LED189.4(GND) LED190.4(GND) LED191.4(GND) LED192.4(GND) LED193.4(GND) LED194.4(GND) LED195.4(GND) LED196.4(GND) LED197.4(GND) LED198.4(GND) LED199.4(GND) LED200.4(GND) LED201.4(GND) LED202.4(GND) LED203.4(GND) LED204.4(GND) LED205.4(GND) LED206.4(GND) LED207.4(GND) LED208.4(GND) LED209.4(GND) LED210.4(GND) LED211.4(GND) LED212.4(GND) LED213.4(GND) LED214.4(GND) LED215.4(GND) LED216.4(GND) LED217.4(GND) LED218.4(GND) LED219.4(GND) LED220.4(GND) LED221.4(GND) LED222.4(GND) LED223.4(GND) R5.1 R9.1 R10.2 SC1.1 SW1.1 U1.3(GND) U2.4(VSS) U3.1(GND/ADJ) U4.1(GND) U4.2(GND) U4.11(GND) U4.14(GND) U4.36(GND) U4.37(GND) U4.38(GND) U4.39(GND) U4.40(GND) U4.41(GND) U4.42(GND) U4.43(GND) U4.44(GND) U4.45(GND) U4.46(GND) U4.47(GND) U4.48(GND) U4.49(GND) U4.50(GND) U4.51(GND) U4.52(GND) U4.53(GND) USBC1.A1(GND) USBC1.A12(GND)
VBUS: D3.1 D4.2(+) USBC1.A4(VBUS) USBC1.A9(VBUS)
ANA_CLK_LEDS_DIN_5V: LED187.3(DO) LED188.1(DIN)
D+: D1.1 U4.27(IO19) USBC1.A6(DP1) USBC1.B6(DP2)
D-: D2.1 U4.26(IO18) USBC1.A7(DN1) USBC1.B7(DN2)
EN_RESET: C1.1 R6.1 SW1.2 U4.8(EN)
IO0_RTC_INT_A3: U2.3(INT#) U4.12(IO0)
IO1_ADC_A2: C2.2 Q1.2(E1) R5.2 U4.13(IO1)
IO2_LEDS_3V3: R7.2 U1.2(A) U4.5(IO2)
IO3_PRESS_A1: JOY1.2 U4.6(IO3)
IO4_LEFT: JOY1.4 U4.18(IO4)
IO5_SDA: CN1.3 H1.7 R1.2 U2.5(SDA) U4.19(IO5)
IO6_SCL: CN1.4 H1.8 R2.2 U2.6(SCL) U4.20(IO6)
IO7_DOWN: JOY1.1 U4.21(IO7)
IO8: H1.4 R8.2 U4.22(IO8)
IO9_RIGHT_BOOT: JOY1.3 U4.23(IO9)
IO10_UP: JOY1.6 U4.16(IO10)
IO20_RXD: H1.5 U4.30(RXD0)
IO21_TXD: H1.6 R3.2
LEDS_DIN_5V: LED1.1(DIN) R4.2
Net-(C11-1): C11.1 U2.1(OSCI) X1.2
Net-(D5-1): D5.1(-) SC1.2 U2.8(VDD)
Net-(LED1-3): LED1.3(DO) LED2.1(DIN)
Net-(LED2-3): LED2.3(DO) LED3.1(DIN)
Net-(LED3-3): LED3.3(DO) LED4.1(DIN)
Net-(LED4-3): LED4.3(DO) LED5.1(DIN)
Net-(LED5-3): LED5.3(DO) LED6.1(DIN)
Net-(LED6-3): LED6.3(DO) LED7.1(DIN)
Net-(LED7-3): LED7.3(DO) LED8.1(DIN)
Net-(LED8-3): LED8.3(DO) LED9.1(DIN)
Net-(LED9-3): LED9.3(DO) LED10.1(DIN)
Net-(LED10-3): LED10.3(DO) LED11.1(DIN)
Net-(LED11-3): LED11.3(DO) LED12.1(DIN)
Net-(LED12-3): LED12.3(DO) LED13.1(DIN)
Net-(LED13-3): LED13.3(DO) LED14.1(DIN)
Net-(LED14-3): LED14.3(DO) LED15.1(DIN)
Net-(LED15-3): LED15.3(DO) LED16.1(DIN)
Net-(LED16-3): LED16.3(DO) LED17.1(DIN)
Net-(LED17-3): LED17.3(DO) LED18.1(DIN)
Net-(LED18-3): LED18.3(DO) LED19.1(DIN)
Net-(LED19-3): LED19.3(DO) LED20.1(DIN)
Net-(LED20-3): LED20.3(DO) LED21.1(DIN)
Net-(LED21-3): LED21.3(DO) LED22.1(DIN)
Net-(LED22-3): LED22.3(DO) LED23.1(DIN)
Net-(LED23-3): LED23.3(DO) LED24.1(DIN)
Net-(LED24-3): LED24.3(DO) LED25.1(DIN)
Net-(LED25-3): LED25.3(DO) LED26.1(DIN)
Net-(LED26-3): LED26.3(DO) LED27.1(DIN)
Net-(LED27-3): LED27.3(DO) LED28.1(DIN)
Net-(LED28-3): LED28.3(DO) LED29.1(DIN)
Net-(LED29-3): LED29.3(DO) LED30.1(DIN)
Net-(LED30-3): LED30.3(DO) LED31.1(DIN)
Net-(LED31-3): LED31.3(DO) LED32.1(DIN)
Net-(LED32-3): LED32.3(DO) LED33.1(DIN)
Net-(LED33-3): LED33.3(DO) LED34.1(DIN)
Net-(LED34-3): LED34.3(DO) LED35.1(DIN)
Net-(LED35-3): LED35.3(DO) LED36.1(DIN)
Net-(LED36-3): LED36.3(DO) LED37.1(DIN)
Net-(LED37-3): LED37.3(DO) LED38.1(DIN)
Net-(LED38-3): LED38.3(DO) LED39.1(DIN)
Net-(LED39-3): LED39.3(DO) LED40.1(DIN)
Net-(LED40-3): LED40.3(DO) LED41.1(DIN)
Net-(LED41-3): LED41.3(DO) LED42.1(DIN)
Net-(LED42-3): LED42.3(DO) LED43.1(DIN)
Net-(LED43-3): LED43.3(DO) LED44.1(DIN)
Net-(LED44-3): LED44.3(DO) LED45.1(DIN)
Net-(LED45-3): LED45.3(DO) LED46.1(DIN)
Net-(LED46-3): LED46.3(DO) LED47.1(DIN)
Net-(LED47-3): LED47.3(DO) LED48.1(DIN)
Net-(LED48-3): LED48.3(DO) LED49.1(DIN)
Net-(LED49-3): LED49.3(DO) LED50.1(DIN)
Net-(LED50-3): LED50.3(DO) LED51.1(DIN)
Net-(LED51-3): LED51.3(DO) LED52.1(DIN)
Net-(LED52-3): LED52.3(DO) LED53.1(DIN)
Net-(LED53-3): LED53.3(DO) LED54.1(DIN)
Net-(LED54-3): LED54.3(DO) LED55.1(DIN)
Net-(LED55-3): LED55.3(DO) LED56.1(DIN)
Net-(LED56-3): LED56.3(DO) LED57.1(DIN)
Net-(LED57-3): LED57.3(DO) LED58.1(DIN)
Net-(LED58-3): LED58.3(DO) LED59.1(DIN)
Net-(LED59-3): LED59.3(DO) LED60.1(DIN)
Net-(LED60-3): LED60.3(DO) LED61.1(DIN)
Net-(LED61-3): LED61.3(DO) LED62.1(DIN)
Net-(LED62-3): LED62.3(DO) LED63.1(DIN)
Net-(LED63-3): LED63.3(DO) LED64.1(DIN)
Net-(LED64-3): LED64.3(DO) LED65.1(DIN)
Net-(LED65-3): LED65.3(DO) LED66.1(DIN)
Net-(LED66-3): LED66.3(DO) LED67.1(DIN)
Net-(LED67-3): LED67.3(DO) LED68.1(DIN)
Net-(LED68-3): LED68.3(DO) LED69.1(DIN)
Net-(LED69-3): LED69.3(DO) LED70.1(DIN)
Net-(LED70-3): LED70.3(DO) LED71.1(DIN)
Net-(LED71-3): LED71.3(DO) LED72.1(DIN)
Net-(LED72-3): LED72.3(DO) LED73.1(DIN)
Net-(LED73-3): LED73.3(DO) LED74.1(DIN)
Net-(LED74-3): LED74.3(DO) LED75.1(DIN)
Net-(LED75-3): LED75.3(DO) LED76.1(DIN)
Net-(LED76-3): LED76.3(DO) LED77.1(DIN)
Net-(LED77-3): LED77.3(DO) LED78.1(DIN)
Net-(LED78-3): LED78.3(DO) LED79.1(DIN)
Net-(LED79-3): LED79.3(DO) LED80.1(DIN)
Net-(LED80-3): LED80.3(DO) LED81.1(DIN)
Net-(LED81-3): LED81.3(DO) LED82.1(DIN)
Net-(LED82-3): LED82.3(DO) LED83.1(DIN)
Net-(LED83-3): LED83.3(DO) LED84.1(DIN)
Net-(LED84-3): LED84.3(DO) LED85.1(DIN)
Net-(LED85-3): LED85.3(DO) LED86.1(DIN)
Net-(LED86-3): LED86.3(DO) LED87.1(DIN)
Net-(LED87-3): LED87.3(DO) LED88.1(DIN)
Net-(LED88-3): LED88.3(DO) LED89.1(DIN)
Net-(LED89-3): LED89.3(DO) LED90.1(DIN)
Net-(LED90-3): LED90.3(DO) LED91.1(DIN)
Net-(LED91-3): LED91.3(DO) LED92.1(DIN)
Net-(LED92-3): LED92.3(DO) LED93.1(DIN)
Net-(LED93-3): LED93.3(DO) LED94.1(DIN)
Net-(LED94-3): LED94.3(DO) LED95.1(DIN)
Net-(LED95-3): LED95.3(DO) LED96.1(DIN)
Net-(LED96-3): LED96.3(DO) LED97.1(DIN)
Net-(LED97-3): LED97.3(DO) LED98.1(DIN)
Net-(LED98-3): LED98.3(DO) LED99.1(DIN)
Net-(LED99-3): LED99.3(DO) LED100.1(DIN)
Net-(LED100-3): LED100.3(DO) LED101.1(DIN)
Net-(LED101-3): LED101.3(DO) LED102.1(DIN)
Net-(LED102-3): LED102.3(DO) LED103.1(DIN)
Net-(LED103-3): LED103.3(DO) LED104.1(DIN)
Net-(LED104-3): LED104.3(DO) LED105.1(DIN)
Net-(LED105-3): LED105.3(DO) LED106.1(DIN)
Net-(LED106-3): LED106.3(DO) LED107.1(DIN)
Net-(LED107-3): LED107.3(DO) LED108.1(DIN)
Net-(LED108-3): LED108.3(DO) LED109.1(DIN)
Net-(LED109-3): LED109.3(DO) LED110.1(DIN)
Net-(LED110-3): LED110.3(DO) LED111.1(DIN)
Net-(LED111-3): LED111.3(DO) LED112.1(DIN)
Net-(LED112-3): LED112.3(DO) LED113.1(DIN)
Net-(LED113-3): LED113.3(DO) LED114.1(DIN)
Net-(LED114-3): LED114.3(DO) LED115.1(DIN)
Net-(LED115-3): LED115.3(DO) LED116.1(DIN)
Net-(LED116-3): LED116.3(DO) LED117.1(DIN)
Net-(LED117-3): LED117.3(DO) LED118.1(DIN)
Net-(LED118-3): LED118.3(DO) LED119.1(DIN)
Net-(LED119-3): LED119.3(DO) LED120.1(DIN)
Net-(LED120-3): LED120.3(DO) LED121.1(DIN)
Net-(LED121-3): LED121.3(DO) LED122.1(DIN)
Net-(LED122-3): LED122.3(DO) LED123.1(DIN)
Net-(LED123-3): LED123.3(DO) LED124.1(DIN)
Net-(LED124-3): LED124.3(DO) LED125.1(DIN)
Net-(LED125-3): LED125.3(DO) LED126.1(DIN)
Net-(LED126-3): LED126.3(DO) LED127.1(DIN)
Net-(LED127-3): LED127.3(DO) LED128.1(DIN)
Net-(LED128-3): LED128.3(DO) LED129.1(DIN)
Net-(LED129-3): LED129.3(DO) LED130.1(DIN)
Net-(LED130-3): LED130.3(DO) LED131.1(DIN)
Net-(LED131-3): LED131.3(DO) LED132.1(DIN)
Net-(LED132-3): LED132.3(DO) LED133.1(DIN)
Net-(LED133-3): LED133.3(DO) LED134.1(DIN)
Net-(LED134-3): LED134.3(DO) LED135.1(DIN)
Net-(LED135-3): LED135.3(DO) LED136.1(DIN)
Net-(LED136-3): LED136.3(DO) LED137.1(DIN)
Net-(LED137-3): LED137.3(DO) LED138.1(DIN)
Net-(LED138-3): LED138.3(DO) LED139.1(DIN)
Net-(LED139-3): LED139.3(DO) LED140.1(DIN)
Net-(LED140-3): LED140.3(DO) LED141.1(DIN)
Net-(LED141-3): LED141.3(DO) LED142.1(DIN)
Net-(LED142-3): LED142.3(DO) LED143.1(DIN)
Net-(LED143-3): LED143.3(DO) LED144.1(DIN)
Net-(LED144-3): LED144.3(DO) LED145.1(DIN)
Net-(LED145-3): LED145.3(DO) LED146.1(DIN)
Net-(LED146-3): LED146.3(DO) LED147.1(DIN)
Net-(LED147-3): LED147.3(DO) LED148.1(DIN)
Net-(LED148-3): LED148.3(DO) LED149.1(DIN)
Net-(LED149-3): LED149.3(DO) LED150.1(DIN)
Net-(LED150-3): LED150.3(DO) LED151.1(DIN)
Net-(LED151-3): LED151.3(DO) LED152.1(DIN)
Net-(LED152-3): LED152.3(DO) LED153.1(DIN)
Net-(LED153-3): LED153.3(DO) LED154.1(DIN)
Net-(LED154-3): LED154.3(DO) LED155.1(DIN)
Net-(LED155-3): LED155.3(DO) LED156.1(DIN)
Net-(LED156-3): LED156.3(DO) LED157.1(DIN)
Net-(LED157-3): LED157.3(DO) LED158.1(DIN)
Net-(LED158-3): LED158.3(DO) LED159.1(DIN)
Net-(LED159-3): LED159.3(DO) LED160.1(DIN)
Net-(LED160-3): LED160.3(DO) LED161.1(DIN)
Net-(LED161-3): LED161.3(DO) LED162.1(DIN)
Net-(LED162-3): LED162.3(DO) LED163.1(DIN)
Net-(LED163-3): LED163.3(DO) LED164.1(DIN)
Net-(LED164-3): LED164.3(DO) LED165.1(DIN)
Net-(LED165-3): LED165.3(DO) LED166.1(DIN)
Net-(LED166-3): LED166.3(DO) LED167.1(DIN)
Net-(LED167-3): LED167.3(DO) LED168.1(DIN)
Net-(LED168-3): LED168.3(DO) LED169.1(DIN)
Net-(LED169-3): LED169.3(DO) LED170.1(DIN)
Net-(LED170-3): LED170.3(DO) LED171.1(DIN)
Net-(LED171-3): LED171.3(DO) LED172.1(DIN)
Net-(LED172-3): LED172.3(DO) LED173.1(DIN)
Net-(LED173-3): LED173.3(DO) LED174.1(DIN)
Net-(LED174-3): LED174.3(DO) LED175.1(DIN)
Net-(LED175-3): LED175.3(DO) LED176.1(DIN)
Net-(LED176-3): LED176.3(DO) LED177.1(DIN)
Net-(LED177-3): LED177.3(DO) LED178.1(DIN)
Net-(LED178-3): LED178.3(DO) LED179.1(DIN)
Net-(LED179-3): LED179.3(DO) LED180.1(DIN)
Net-(LED180-3): LED180.3(DO) LED181.1(DIN)
Net-(LED181-3): LED181.3(DO) LED182.1(DIN)
Net-(LED182-3): LED182.3(DO) LED183.1(DIN)
Net-(LED183-3): LED183.3(DO) LED184.1(DIN)
Net-(LED184-3): LED184.3(DO) LED185.1(DIN)
Net-(LED185-3): LED185.3(DO) LED186.1(DIN)
Net-(LED186-3): LED186.3(DO) LED187.1(DIN)
Net-(LED188-3): LED188.3(DO) LED189.1(DIN)
Net-(LED189-3): LED189.3(DO) LED190.1(DIN)
Net-(LED190-3): LED190.3(DO) LED191.1(DIN)
Net-(LED191-3): LED191.3(DO) LED192.1(DIN)
Net-(LED192-3): LED192.3(DO) LED193.1(DIN)
Net-(LED193-3): LED193.3(DO) LED194.1(DIN)
Net-(LED194-3): LED194.3(DO) LED195.1(DIN)
Net-(LED195-3): LED195.3(DO) LED196.1(DIN)
Net-(LED196-3): LED196.3(DO) LED197.1(DIN)
Net-(LED197-3): LED197.3(DO) LED198.1(DIN)
Net-(LED198-3): LED198.3(DO) LED199.1(DIN)
Net-(LED199-3): LED199.3(DO) LED200.1(DIN)
Net-(LED200-3): LED200.3(DO) LED201.1(DIN)
Net-(LED201-3): LED201.3(DO) LED202.1(DIN)
Net-(LED202-3): LED202.3(DO) LED203.1(DIN)
Net-(LED203-3): LED203.3(DO) LED204.1(DIN)
Net-(LED204-3): LED204.3(DO) LED205.1(DIN)
Net-(LED205-3): LED205.3(DO) LED206.1(DIN)
Net-(LED206-3): LED206.3(DO) LED207.1(DIN)
Net-(LED207-3): LED207.3(DO) LED208.1(DIN)
Net-(LED208-3): LED208.3(DO) LED209.1(DIN)
Net-(LED209-3): LED209.3(DO) LED210.1(DIN)
Net-(LED210-3): LED210.3(DO) LED211.1(DIN)
Net-(LED211-3): LED211.3(DO) LED212.1(DIN)
Net-(LED212-3): LED212.3(DO) LED213.1(DIN)
Net-(LED213-3): LED213.3(DO) LED214.1(DIN)
Net-(LED214-3): LED214.3(DO) LED215.1(DIN)
Net-(LED215-3): LED215.3(DO) LED216.1(DIN)
Net-(LED216-3): LED216.3(DO) LED217.1(DIN)
Net-(LED217-3): LED217.3(DO) LED218.1(DIN)
Net-(LED218-3): LED218.3(DO) LED219.1(DIN)
Net-(LED219-3): LED219.3(DO) LED220.1(DIN)
Net-(LED220-3): LED220.3(DO) LED221.1(DIN)
Net-(LED221-3): LED221.3(DO) LED222.1(DIN)
Net-(LED222-3): LED222.3(DO) LED223.1(DIN)
Net-(R3-1): R3.1 U4.31(TXD0)
Net-(R4-1): R4.1 U1.4(Y)
Net-(R9-2): R9.2 USBC1.B5(CC2)
Net-(R10-1): R10.1 USBC1.A5(CC1)
Net-(U2-2): U2.2(OSCO) X1.1

Not connected (* = marked no-connect by the designer): CN1 0*; JOY1 7* 8*; LED223 3(DO)*; U1 1(NC)*; U2 7(CLKOUT)*; U3 4(Vout)*; U4 4(NC)* 7(NC)* 9(NC)* 10(NC)* 15(NC)* 17(NC)* 24(NC)* 25(NC)* 28(NC)* 29(NC)* 32(NC)* 33(NC)* 34(NC)* 35(NC)*; USBC1 0* A8(SBU1)* B8(SBU2)*

## Notes on the sheet
- ESP32-C3-MINI Microcontroller/WiFi/BLE Module
- Real-time clock with supercap backup
- USB-C Port
- 5-way joystick
- This Schottky diode ensures
  the super-cap powers only
  the RTC.
- The ESP32-C3 has built-in
  hardware Serial/JTAG over USB.
- 220mF Supercapacitor
- Light sensor
- 2.54mm 8 pin header
- ESD protection
- 3.3V Power Supply (800mA)
- 10ms boot delay
- I2C (QWIIC/STEMMA QT)
- Output
- 3.3V to 5V data level shift for TC2020 data input
- NOTE: If the joystick is held RIGHT while
  powering up (resetting), the ESP32-C3
  will enter firmware WRITE (bootloader) mode.
- Input
- (+5V VBUS)
- This 1mm pitch 4 pin JST
  connector is compatible with
  SparkFun's QWIIC and
  Adafruit's STEMMA QT products.
- 17x11 LED matrix
- 12x3 Analog Clock Circular LED matrix
- Foxie CardClock 2.0
